# EAGLE design programmer (EAGLE 6.2)
An AVR in-system programmer.
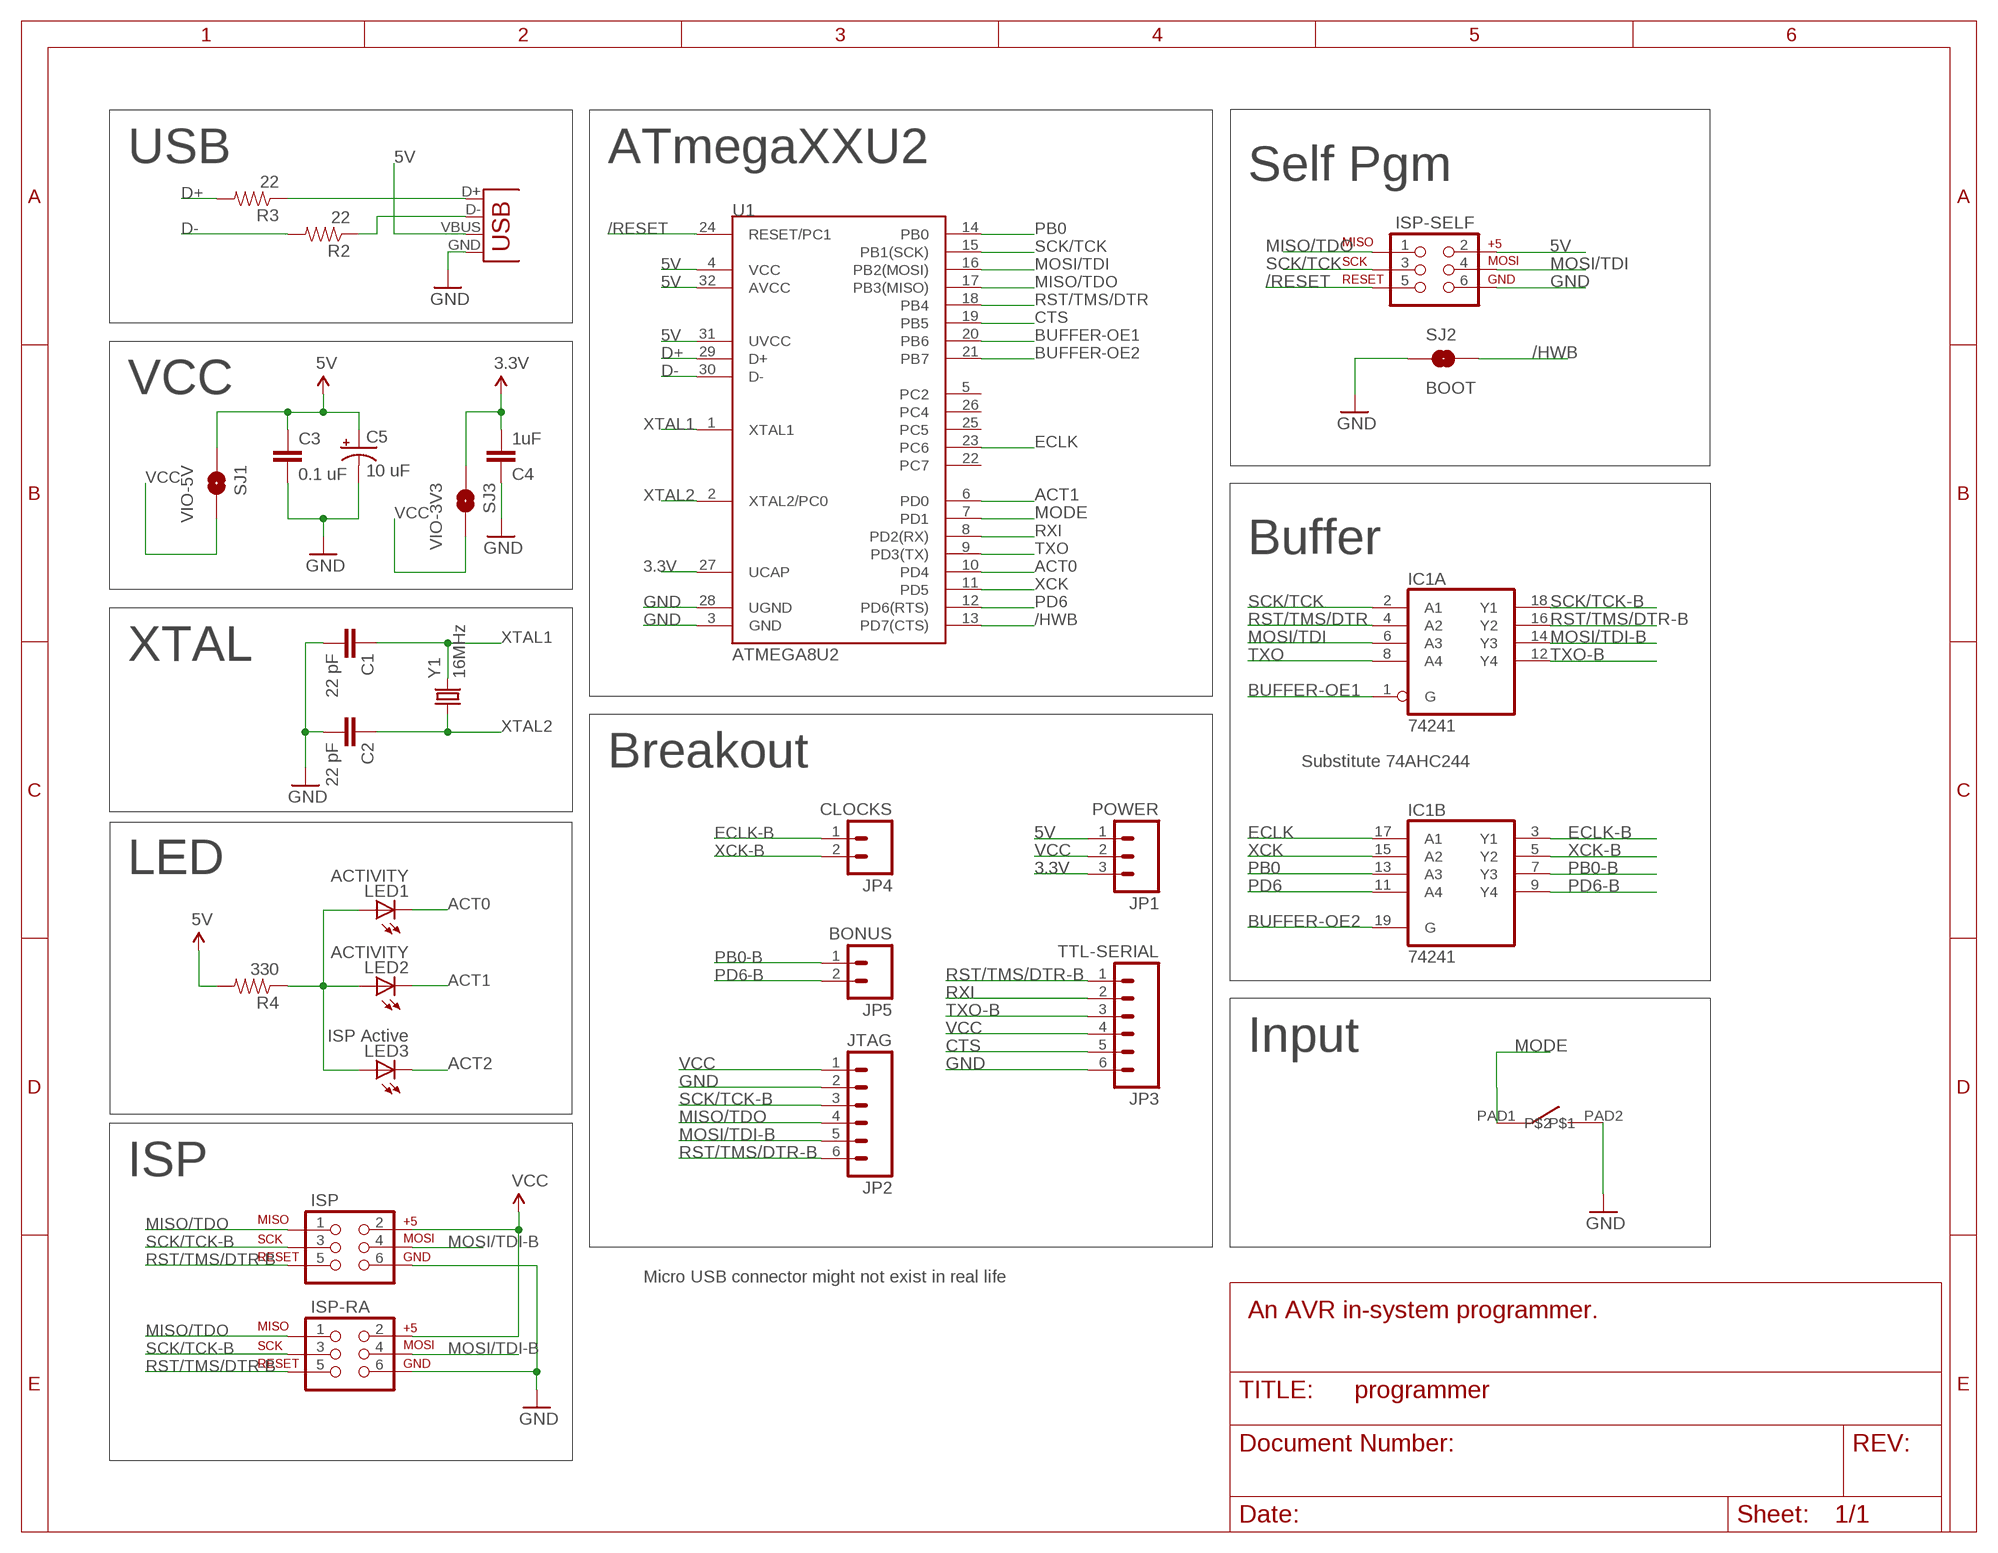
[diagram p0: schematic, sheet 1]

## Parts
C1  22 pF  SPARKFUN_CAP0805  [SPARKFUN_0805]
C2  22 pF  SPARKFUN_CAP0805  [SPARKFUN_0805]
C3  0.1 uF  SPARKFUN_CAP0805  [SPARKFUN_0805]
C4  1uF  SPARKFUN_CAP0805  [SPARKFUN_0805]
C5  10 uF  SPARKFUN_CAP_POL1206  [SPARKFUN_EIA3216]
IC1  74241  [TSSOP20]
ISP  SPARKFUN_AVR_SPI_PRG_62X3_LOCK  [SPARKFUN_2X3_LOCK]
ISP-RA  SPARKFUN_AVR_SPI_PRG_62X3_LOCK  [SPARKFUN_2X3_LOCK]
ISP-SELF  SPARKFUN_AVR_SPI_PRG_62X3_LOCK  [SPARKFUN_2X3_LOCK]
JP1  POWER  SPARKFUN_M03LOCK  [SPARKFUN_1X03_LOCK]
JP2  JTAG  SPARKFUN_M06LOCK  [SPARKFUN_1X06_LOCK]
JP3  TTL-SERIAL  SPARKFUN_M06LOCK  [SPARKFUN_1X06_LOCK]
JP4  CLOCKS  M02LOCK  [1X02_LOCK]
JP5  BONUS  M02LOCK  [1X02_LOCK]
LED1  ACTIVITY  SPARKFUN_LED  [CHIP-LED0805]
LED2  ACTIVITY  SPARKFUN_LED  [CHIP-LED0805]
LED3  ISP Active  SPARKFUN_LED  [CHIP-LED0805]
R2  22  SPARKFUN_RESISTOR0805-RES  [SPARKFUN_0805]
R3  22  SPARKFUN_RESISTOR0805-RES  [SPARKFUN_0805]
R4  330  SPARKFUN_RESISTOR0805-RES  [SPARKFUN_0805]
SJ1  VIO-5V  SPARKFUN_SOLDERJUMPERNC  [SPARKFUN_SJ_2S]
SJ2  BOOT  SPARKFUN_SOLDERJUMPERNO  [SPARKFUN_SJ_2S-NO]
SJ3  VIO-3V3  SPARKFUN_SOLDERJUMPERNC  [SPARKFUN_SJ_2S]
SW1  BUTTON_TD-85XU  [BUTTON_TD-85XU]
U1  ATMEGA8U2  SPARKFUN_ATMEGA8U2AU  [SPARKFUN_TQFP32-08]
X1  FCI_8193_MICRO_USB  [FCI_MICRO_USB_8193]
Y1  16MHz  SPARKFUN_CRYSTAL5X3  [SPARKFUN_CRYSTAL-SMD-5X3]

## Nets
3.3V: C4.2 JP1.3 SJ3.1 U1.27(UCAP)
5V [pwr/gnd]: C3.1 C5.A(+) ISP-SELF.2 JP1.1 R4.2 SJ1.1 U1.4(VCC) U1.31(UVCC) U1.32(AVCC) X1.VBUS
/HWB: SJ2.2 U1.13(PD7(CTS))
/RESET: ISP-SELF.5 U1.24(RESET/PC1)
ACT0: LED1.C U1.10(PD4)
ACT1: LED2.C U1.6(PD0)
ACT2: LED3.C
BUFFER-OE1: IC1.1(A:G) U1.20(PB6)
BUFFER-OE2: IC1.19(B:G) U1.21(PB7)
CTS: JP3.5 U1.19(PB5)
D+: R3.2 U1.29(D+)
D+RAW: R3.1 X1.D+
D-: R2.2 U1.30(D-)
D-RAW: R2.1 X1.D-
ECLK: IC1.17(B:A1) U1.23(PC6)
ECLK-B: IC1.3(B:Y1) JP4.1
GND [pwr/gnd]: C1.2 C2.2 C3.2 C4.1 C5.C(-) ISP-RA.6 ISP-SELF.6 ISP.6 JP2.2 JP3.6 SJ2.1 SW1.PAD2 U1.3(GND) U1.28(UGND) X1.GND
MISO/TDO: ISP-RA.1 ISP-SELF.1 ISP.1 JP2.4 U1.17(PB3(MISO))
MODE: SW1.PAD1 U1.7(PD1)
MOSI/TDI: IC1.6(A:A3) ISP-SELF.4 U1.16(PB2(MOSI))
MOSI/TDI-B: IC1.14(A:Y3) ISP-RA.4 ISP.4 JP2.5
PB0: IC1.13(B:A3) U1.14(PB0)
PB0-B [pwr/gnd]: IC1.7(B:Y3) JP5.1
PD6: IC1.11(B:A4) U1.12(PD6(RTS))
PD6-B [pwr/gnd]: IC1.9(B:Y4) JP5.2
RST/TMS/DTR: IC1.4(A:A2) U1.18(PB4)
RST/TMS/DTR-B: IC1.16(A:Y2) ISP-RA.5 ISP.5 JP2.6 JP3.1
RXI: JP3.2 U1.8(PD2(RX))
SCK/TCK: IC1.2(A:A1) ISP-SELF.3 U1.15(PB1(SCK))
SCK/TCK-B: IC1.18(A:Y1) ISP-RA.3 ISP.3 JP2.3
TXO: IC1.8(A:A4) U1.9(PD3(TX))
TXO-B: IC1.12(A:Y4) JP3.3
VCC [pwr/gnd]: ISP-RA.2 ISP.2 JP1.2 JP2.1 JP3.4 SJ1.2 SJ3.2
VCC-LED: LED1.A LED2.A R4.1
VCC-LED1: LED3.A
XCK: IC1.15(B:A2) U1.11(PD5)
XCK-B: IC1.5(B:Y2) JP4.2
XTAL1: C1.1 U1.1(XTAL1) Y1.3
XTAL2: C2.1 U1.2(XTAL2/PC0) Y1.1
Unconnected: U1.5(PC2) U1.22(PC7) U1.25(PC5) U1.26(PC4)

## Notes on the sheet
- USB | ATmegaXXU2
- Self Pgm
- VCC
- Buffer
- XTAL
- Breakout | Substitute 74AHC244
- LED
- Input
- ISP
- Micro USB connector might not exist in real life
- An AVR in-system programmer.

## Power pins joined to a net without a drawn wire
GND: IC1.10(P:GND)
VCC: IC1.20(P:VCC)

## Library data of the parts
C1-C4 = programmer:SPARKFUN_CAP: Capacitor Standard 0603 ceramic capacitor, and 0.1" leaded capacitor.
C5 = programmer:SPARKFUN_CAP_POL: Capacitor Polarized These are standard SMD and PTH capacitors. Normally 10uF, 47uF, and 100uF in electrolytic and tantalum varieties. Always verify the external diameter of the through hole cap, it varies with capacity, voltage, and manufacturer. The EIA devices should be standard.
IC1 = programmer:74*241: Octal BUFFER and LINE DRIVER, 3-state
ISP ISP-RA ISP-SELF = programmer:SPARKFUN_AVR_SPI_PRG_6: AVR ISP 6 Pin This is the reduced ISP connector for AVR programming. Common on Arduino. This footprint will take up less PCB space and can be used with a 10-pin to 6-pin adapter such as SKU: BOB-08508
JP1 = programmer:SPARKFUN_M03: Header 3 Standard 3-pin 0.1" header. Use with straight break away headers (SKU : PRT-00116), right angle break away headers (PRT-00553), swiss pins (PRT-00743), machine pins (PRT-00117), and female headers (PRT-00115). Molex polarized connector foot print use with SKU : PRT-08232 with associated crimp pins and housings.
JP2 JP3 = programmer:SPARKFUN_M06
JP4 JP5 = programmer:M02: Header 2 Standard 2-pin 0.1" header. Use with straight break away headers (SKU : PRT-00116), right angle break away headers (PRT-00553), swiss pins (PRT-00743), machine pins (PRT-00117), and female headers (PRT-00115). Molex polarized connector foot print use with SKU : PRT-08233 with associated crimp pins and housings.
LED1-LED3 = programmer:SPARKFUN_LED: LEDs Standard schematic elements and footprints for 5mm, 3mm, 1206, and 0603 sized LEDs. 5mm - Spark Fun Electronics SKU : COM-00529 (and others)
R2-R4 = programmer:SPARKFUN_RESISTOR: Resistor Basic schematic elements and footprints for 0603, 1206, and PTH resistors.
SJ1-SJ3 = programmer:SPARKFUN_SOLDERJUMPER: Solder Jumper Standard SMD solder jumper. Used to automate production. Two varients : Normally Open and Normally Closed are the same, but have different paste layers. NC will have a large amount of paste and should jumper during reflow.
SW1 = programmer:BUTTON_TD-85XU
U1 = programmer:SPARKFUN_ATMEGA8U2: Atmel 8-bit Microcontroller with 8/16/32K Bystes of ISP Flash and USB Controller. ATmega8U2, ATmega16U2, and ATmega32U2
X1 = programmer:FCI_8193_MICRO_USB
Y1 = programmer:SPARKFUN_CRYSTAL: Crystals Various standard crystals. Proven footprints. Spark Fun Electronics SKU : COM-00534

## Net classes
0 default: width 0.203 mm, clearance 0.203 mm
1 pwr/gnd: width 0.305 mm

## Board
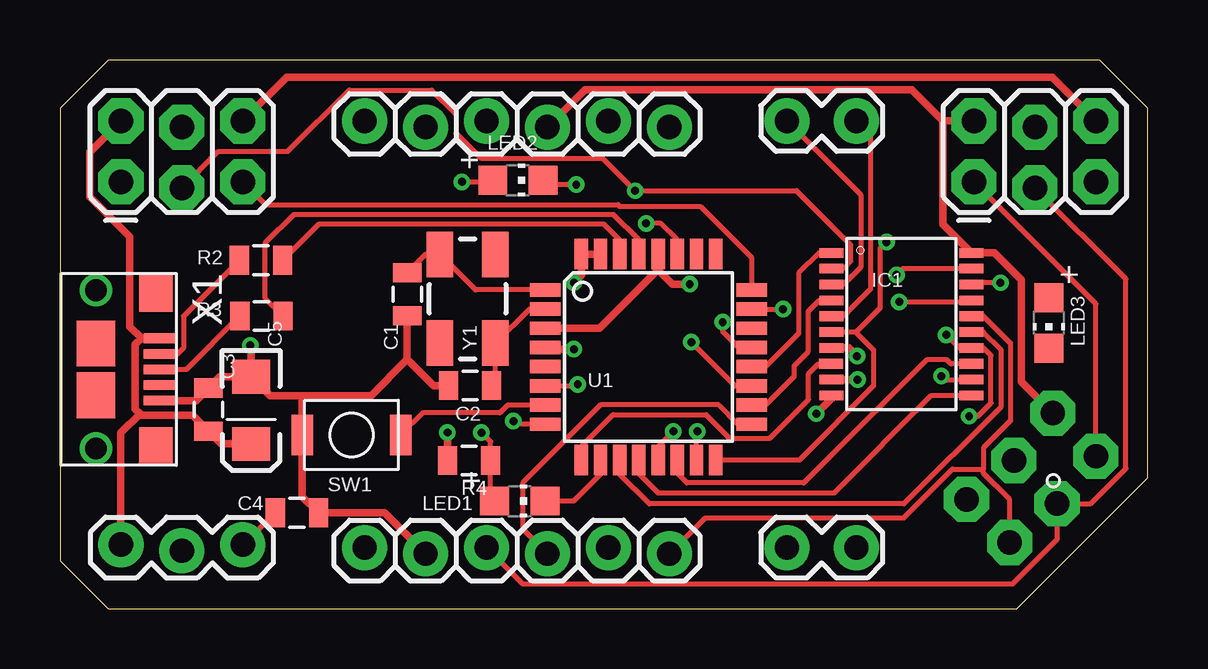
[diagram p1: board, top side]
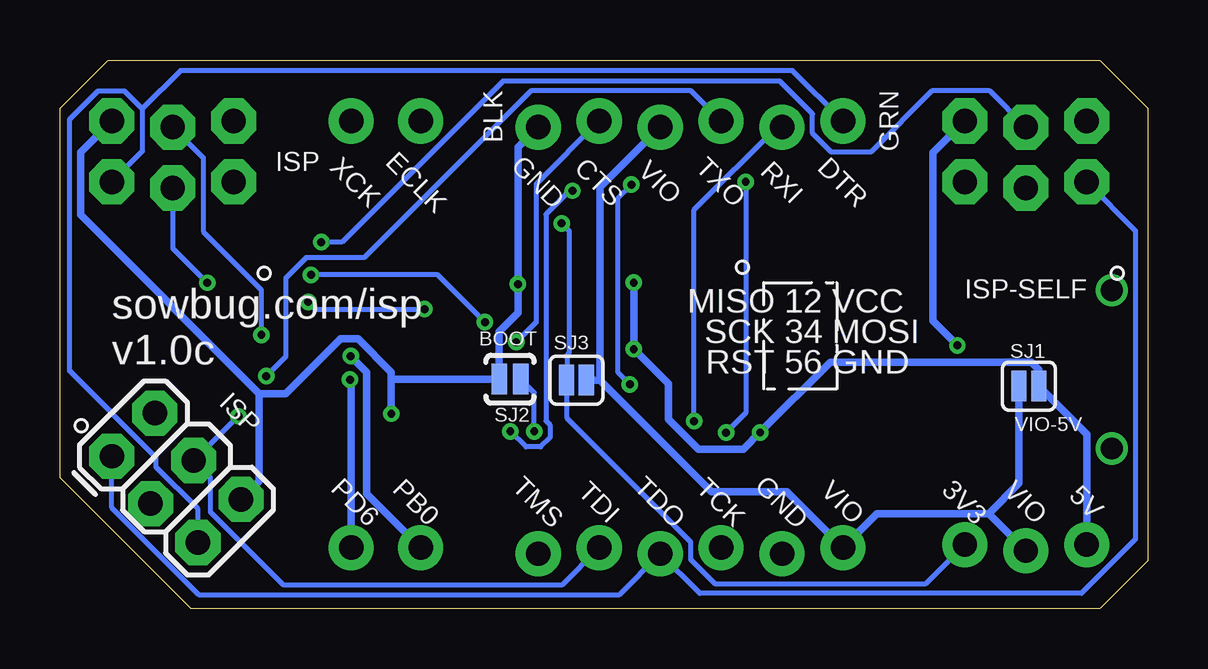
[diagram p2: board, bottom side, seen from below]

Size 45.34 x 22.86 mm. Coordinates in mm from the lower left corner, seen from the top.
Outline: 45.34,5.46 45.34,20.86 43.34,22.86 2,22.86 0,20.86 0,2 2,0 39.88,0 45.34,5.46
Copper layers (1*16): Top 0.0356mm / dielectric 1.5011mm / Bottom 0.0356mm
Design rules: minimum track width 6mil, minimum drill 13mil, track to track 6mil, track to pad 6mil, pad to pad 6mil, via to via 6mil, smd to smd 6mil, copper to edge 15mil, drill to drill 6mil, minimum pad ring 7mil, minimum via ring 7mil, stop-mask expansion 4mil, vias tented up to drill 0mil, thermal gap 10mil

### Footprints (pad centres in the part's own frame; a part is rotated, then mirrored left to right if it is on the bottom)
SPARKFUN_0805 = smd 0.8 x 1.2: 1 -0.9,0; 2 0.9,0
SPARKFUN_EIA3216 = smd 1.4 x 1.6: A 1.4,0; C -1.4,0
TSSOP20 = smd 1 x 0.4: 1 -2.937,2.693; 2 -2.937,2.032; 3 -2.937,1.372; 4 -2.937,0.712; 5 -2.937,0.051; 6 -2.937,-0.609; 7 -2.937,-1.27; 8 -2.943,-1.93; 9 -2.937,-2.59; 10 -2.937,-3.251; 11 2.905,-3.251; 12 2.905,-2.59; 13 2.911,-1.93; 14 2.905,-1.27; 15 2.905,-0.609; 16 2.905,0.051; 17 2.905,0.712; 18 2.905,1.372; 19 2.905,2.032; 20 2.905,2.693
SPARKFUN_2X3_LOCK = drill 1.016 pad 1.88 octagon: 1 0,0; 2 0,2.54; 3 2.54,-0.254; 4 2.54,2.286; 5 5.08,0; 6 5.08,2.54
SPARKFUN_1X03_LOCK = drill 1.016 pad 1.88: 1 0,0.127; 2 2.54,-0.127; 3 5.08,0.127
SPARKFUN_1X06_LOCK = drill 1.016 pad 1.88: 1 0,0; 2 2.54,-0.254; 3 5.08,0; 4 7.62,-0.254; 5 10.16,0; 6 12.7,-0.254
1X02_LOCK = drill 1.016 pad 1.88: 1 -0.178,0; 2 2.718,0
CHIP-LED0805 = smd 1.2 x 1.2: A 0,-1.05; C 0,1.05
SPARKFUN_SJ_2S = smd 0.635 x 1.27: 1 -0.412,0; 2 0.412,0
SPARKFUN_SJ_2S-NO = smd 0.635 x 1.27: 1 -0.45,0; 2 0.45,0
BUTTON_TD-85XU = smd 0.9 x 1.7: PAD1 -2.05,0; PAD2 2.05,0
SPARKFUN_TQFP32-08 = smd 1.27 x 0.559: 1 -4.293,2.8; 2 -4.293,2; 3 -4.293,1.2; 4 -4.293,0.4; 5 -4.293,-0.4; 6 -4.293,-1.2; 7 -4.293,-2; 8 -4.293,-2.8; 17 4.293,-2.8; 18 4.293,-2; 19 4.293,-1.2; 20 4.293,-0.4; 21 4.293,0.4; 22 4.293,1.2; 23 4.293,2; 24 4.293,2.8 | smd 0.559 x 1.27: 9 -2.8,-4.293; 10 -2,-4.293; 11 -1.2,-4.293; 12 -0.4,-4.293; 13 0.4,-4.293; 14 1.2,-4.293; 15 2,-4.293; 16 2.8,-4.293; 25 2.8,4.293; 26 2,4.293; 27 1.2,4.293; 28 0.4,4.293; 29 -0.4,4.293; 30 -1.2,4.293; 31 -2,4.293; 32 -2.8,4.293
FCI_MICRO_USB_8193 = smd 0.4 x 1.35: D+ 0,2.675; D- -0.65,2.675; GND 1.3,2.675; ID 0.65,2.675; VBUS -1.3,2.675 | smd 1.6 x 1.4: MNT1 -3.2,2.5; MNT2 3.2,2.5 | smd 1.9 x 1.6: MNT3 -1.075,0; MNT4 1.075,0 | drill 0.9: P$1 -3.3,0; P$2 3.3,0
SPARKFUN_CRYSTAL-SMD-5X3 = smd 1.9 x 1.1: 1 -1.85,-1.15; 2 1.85,-1.15; 3 1.85,1.15; 4 -1.85,1.15

### Placement (x,y rotation side)
C1  14.48,13.1 270 top
C2  17.1,9.3 180 top
C3  6.19,8.29 90 top
C4  9.88,3.99 180 top
C5  7.97,8.26 270 top
IC1  35.09,12.13 0 top
ISP  38.1,17.78 0 top
ISP-RA  43.18,6.35 315 bottom
ISP-SELF  2.54,17.78 0 top
JP1  2.54,2.54 0 top
JP2  12.7,2.54 0 top
JP3  12.7,20.32 0 top
JP4  30.48,20.32 0 top
JP5  30.48,2.54 0 top
LED1  19.17,4.48 270 top
LED2  19.09,17.85 270 top
LED3  41.22,11.9 180 top
R2  8.38,14.52 0 top
R3  8.4,12.2 0 top
R4  17.05,6.17 180 top
SJ1  4.95,9.27 180 bottom
SJ2  26.58,9.56 0 bottom
SJ3  23.81,9.52 0 bottom
SW1  12.15,7.24 180 top
U1  24.53,10.48 0 top
X1  1.5,9.97 270 top
Y1  16.99,12.91 90 top

### Tracks (layer width: path | path; a pad name or v marks a point on that pad's centre or on a via)
3.3V  (via drill 0.33 pad 0.69)
  Top 0.203: JP1.3 7.66,2.67 C4.2 | U1.27 25.73,15.36 25.04,16.05 v24.43,16.05
  Bottom 0.203: v24.43,16.05 24.11,15.74 | 24.11,15.74 | 24.11,15.74 24.11,13.62 24.11,11.26 | 24.11,11.26 | 24.11,11.26 24.11,10.68 24.2,10.59 SJ3.1 24.22,7.96 19.05,2.79 19.05,2.05 18.04,1.04 9.25,1.04 JP1.3
5V  (via drill 0.33 pad 0.69)
  Top 0.305: C5.A 6.72,6.86 C3.1 5.53,8.05 3.4,8.05 3.34,8.12 | v21.42,13.58 21.73,13.89 U1.32 U1.31 | v21.42,10.81 20.31,10.81 U1.4 | R4.2 v16.15,7.34 | 3.34,8.12 2.54,7.32 JP1.1 | 3.4,11.27 2.91,11.75 2.91,15.49 1.24,17.17 1.24,19.02 ISP-SELF.2 | X1.VBUS 3.4,11.27 | 3.4,11.27 3.14,11.01 3.14,8.32 3.34,8.12
  Bottom 0.305: JP1.1 2.54,7.27 SJ1.1 4.54,9.95 4.85,10.26 13.23,10.26 v16.15,7.34 16.86,6.63 18.72,6.63 19.97,7.88 19.97,9.36 v21.42,10.81 v21.42,13.58
/HWB  (via drill 0.33 pad 0.69)
  Top 0.203: U1.13 24.93,6.75 v25.57,7.39
  Bottom 0.203: v25.57,7.39 25.57,9 SJ2.2
/RESET
  Top 0.203: ISP-SELF.5 8.57,16.83 23.27,16.83 23.33,16.77 26.69,16.77 28.82,14.63 U1.24
ACT0
  Top 0.203: U1.10 22.53,5.61 21.41,4.48 LED1.C
ACT1  (via drill 0.33 pad 0.69)
  Top 0.203: v21.52,17.67 20.32,17.67 LED2.C | U1.6 21.52,9.28 v21.58,9.34
  Bottom 0.203: v21.58,9.34 22.07,9.84 22.07,17.11 v21.52,17.67
BUFFER-OE1
  Top 0.203: IC1.1 31.65,14.82 30.79,13.97 30.79,11.46 29.41,10.08 U1.20
BUFFER-OE2  (via drill 0.33 pad 0.69)
  Top 0.203: IC1.19 35.13,14.16 v34.87,13.91 | U1.21 28.28,10.88 27.62,11.54 v27.62,11.94
  Bottom 0.203: v27.62,11.94 29.59,13.91 v34.87,13.91
CTS  (via drill 0.33 pad 0.69)
  Top 0.203: U1.19 28.14,9.28 v26.32,11.1
  Bottom 0.203: JP3.5 25.5,17.68 25.5,11.93 v26.32,11.1
D+
  Top 0.203: U1.29 24.13,15.37 23.08,16.42 9.74,16.42 8.54,15.22 8.54,12.96 R3.2
D+RAW
  Top 0.203: X1.D+ 5.27,9.97 R3.1
D-
  Top 0.203: U1.30 23.33,15.36 22.68,16.02 10.78,16.02 R2.2
D-RAW
  Top 0.203: R2.1 5.15,12.19 5.15,10.86 4.91,10.62 X1.D-
ECLK  (via drill 0.33 pad 0.69)
  Top 0.203: U1.23 v30.14,12.48 | v34.99,12.79 37.93,12.79 IC1.17
  Bottom 0.203: v34.99,12.79 34.69,12.48 v30.14,12.48
ECLK-B
  Top 0.203: JP4.1 33.38,17.24 33.38,14.23 32.65,13.51 IC1.3
GND  (via drill 0.33 pad 0.69)
  Top 0.305: 10.1,8.87 SW1.PAD2 10.1,4.66 C4.1 13.54,3.99 JP2.2 | 10.1,8.87 12.96,8.87 14.48,10.38 | C5.C 8.76,8.87 10.1,8.87 | 14.48,10.38 C1.2 | C2.2 15.57,9.3 14.48,10.38 | C5.C 6.66,9.66 C3.2 5.67,8.67 X1.GND | 24.93,14.12 25.54,13.52 v26.25,13.52 | IC1.10 32.15,8.74 v31.53,8.12 | ISP-SELF.6 9.44,22.14 41.36,22.14 ISP.6 | 24.93,14.12 U1.28 | 24.93,14.12 22.49,11.68 U1.3 | v7.93,10.97 7.97,10.93 C5.C
  Bottom 0.305: 37.03,8.96 35.92,8.96 33.65,11.24 32.92,11.24 31.53,9.85 31.53,9.56 | ISP.6 44.48,19.02 44.48,16.42 37.03,8.96 | 37.03,8.96 37.03,5.32 ISP-RA.6 | 31.53,9.56 v31.53,8.12 | 31.53,9.56 SJ2.1 27.03,11.54 26.25,12.32 v26.25,13.52 26.25,19.22 JP3.6 | ISP-SELF.6 8.95,18.99 8.95,11.99 v7.93,10.97 | ISP-RA.6 37.85,4.57 ISP-RA.6
MISO/TDO
  Top 0.203: U1.17 28.27,7.68 27.46,8.49 22.54,8.49 19.29,5.24 19.29,3.32 JP2.4 | ISP-RA.1 43.18,12.7 ISP.1
  Bottom 0.203: ISP-SELF.1 0.51,15.75 0.51,2.88 2.76,0.63 18.67,0.63 JP2.4 22.04,0.57 39.53,0.57 43.18,4.21 ISP-RA.1
MODE
  Top 0.203: U1.7 18.66,8.48 18.34,8.16 15.13,8.16 SW1.PAD1
MOSI/TDI  (via drill 0.33 pad 0.69)
  Top 0.203: 33.18,11.52 33.91,10.79 33.91,9.28 30.83,6.19 U1.16 | 33.18,11.52 IC1.6 | 33.18,11.52 34.19,12.53 34.19,15.02 v34.45,15.27
  Bottom 0.203: ISP-SELF.4 6.59,21.57 8.99,21.57 11.54,19.02 13.18,19.02 13.97,19.81 13.97,20.61 15.34,21.98 26.88,21.98 33.59,15.27 v34.45,15.27
MOSI/TDI-B  (via drill 0.33 pad 0.69)
  Top 0.203: v36.95,11.41 37.49,10.86 IC1.14 38.49,10.86 38.8,10.55 38.8,8.56 38.26,8.02 v37.9,8.02
  Bottom 0.203: ISP.4 39.37,18.8 39.37,15.71 36.95,13.29 v36.95,11.41 | 39.61,6.33 ISP-RA.4 39.07,5.47 39.07,4.04 36.04,1 24.4,1 JP2.5 | 39.61,6.33 37.92,8.02 v37.9,8.02 | ISP-RA.4 39.62,6.35 39.61,6.33
PB0
  Top 0.203: IC1.13 37.14,10.2 36.98,10.37 36.13,10.37 31,5.24 26.13,5.24 25.73,5.64 U1.14
PB0-B  (via drill 0.33 pad 0.69)
  Top 0.305: IC1.7 32.88,10.86 v33.22,10.52
  Bottom 0.305: JP5.1 32.55,4.79 32.55,9.85 v33.22,10.52
PD6
  Top 0.203: U1.12 24.13,5.62 24.92,4.83 32.27,4.83 36.33,8.88 IC1.11
PD6-B  (via drill 0.33 pad 0.69)
  Top 0.305: v33.25,9.54 IC1.9
  Bottom 0.305: JP5.2 33.2,9.49 v33.25,9.54
RST/TMS/DTR
  Top 0.203: U1.18 29.41,8.48 30.61,9.68 30.61,10.12 31.2,10.71 31.2,12.39 31.65,12.84 IC1.4
RST/TMS/DTR-B
  Top 0.203: IC1.16 38.49,12.18 39.62,11.06 39.62,7.82 38.49,6.7 38.49,5.81 | ISP-RA.5 | ISP-RA.5 39.59,2.79 | 39.59,2.79 39.59,4.55 38.49,5.65 38.49,5.81 | JP2.6 26.9,3.79 35.18,3.79 37.21,5.81 38.49,5.81 | ISP-RA.5 39.62,2.79 39.59,2.79
  Bottom 0.203: ISP-RA.5 | ISP-RA.5 39.59,2.79 | 39.59,2.79 39.59,4.16 41.33,5.9 41.33,6.3 44.94,9.91 44.94,20.38 43.75,21.58 42.66,21.58 41.91,20.83 | 41.91,20.83 41.91,19.05 ISP.5 | JP3.1 14.8,22.42 40.31,22.42 41.91,20.83 | ISP-RA.5 39.62,2.79 39.59,2.79
RXI  (via drill 0.33 pad 0.69)
  Top 0.203: U1.8 19.03,7.68 v18.91,7.81
  Bottom 0.203: v18.91,7.81 18.91,16.62 15.46,20.07 JP3.2
SCK/TCK  (via drill 0.33 pad 0.69)
  Top 0.203: U1.15 26.53,7.35 v26.57,7.39 | IC1.2 32.65,14.16 32.95,14.47 32.95,15.16 30.71,17.41 v23.97,17.41 22.61,18.77 17.54,18.77 16.51,19.8 16.51,20.59 15.5,21.6 12.05,21.6 9.5,19.05 6.6,19.05 ISP-SELF.3
  Bottom 0.203: v23.97,17.41 24.11,17.41 25.09,16.43 25.09,7.82 24.92,7.66 24.92,7.12 25.3,6.74 25.92,6.74 v26.57,7.39
SCK/TCK-B  (via drill 0.33 pad 0.69)
  Top 0.203: ISP-RA.3 42.97,4.37 44.43,5.83 44.43,13.74 ISP.3 | JP2.3 19.29,1.03 39.71,1.03 41.56,2.89 41.56,4.32 | 41.56,4.32 ISP-RA.3 | v39.2,13.58 38.06,13.58 IC1.18 | ISP-RA.3 41.66,4.32 41.56,4.32
  Bottom 0.203: ISP.3 40.64,15.02 v39.2,13.58
TXO
  Top 0.203: U1.9 21.73,6.76 23.05,8.08 26.93,8.08 27.92,7.1 29.59,7.1 31.2,8.71 31.2,9.79 31.61,10.2 IC1.8
TXO-B  (via drill 0.33 pad 0.69)
  Top 0.203: v36.74,9.69 36.89,9.54 IC1.12
  Bottom 0.203: JP3.3 19.04,21.57 25.71,21.57 32.66,14.63 35.08,14.63 35.93,13.78 35.93,10.5 v36.74,9.69
VCC
  Top 0.305: ISP-RA.2 40.07,9.46 40.07,13.7 38.94,14.82 IC1.20 36.8,16.01 36.8,20.32 | ISP.2 36.8,20.32 | JP3.4 21.88,21.62 35.5,21.62 36.8,20.32 | ISP-RA.2 41.4,8.13 ISP-RA.2
  Bottom 0.305: 22.84,9.52 22.84,17.55 JP3.4 | 22.84,9.52 18.19,4.88 15.04,4.88 JP2.1 11.28,3.96 6.63,3.96 | SJ3.2 22.84,9.52 | 6.63,3.96 JP1.2 | SJ1.2 5.37,5.23 6.63,3.96
VCC-LED  (via drill 0.33 pad 0.69)
  Top 0.203: v17.57,7.34 17.95,6.96 R4.1 17.95,4.65 LED1.A | v16.75,17.78 17.97,17.78 LED2.A
  Bottom 0.203: v16.75,17.78 16.75,8.15 v17.57,7.34
XCK
  Top 0.203: IC1.15 38.49,11.52 39.21,10.81 39.21,8.39 35.19,4.37 24.57,4.37 23.33,5.6 U1.11
XCK-B
  Top 0.203: JP4.2 33.78,19.73 33.78,13.32 32.65,12.18 IC1.5
XTAL1
  Top 0.203: U1.1 17.32,13.28 Y1.3 15.24,14.76 C1.1
XTAL2
  Top 0.203: U1.2 19.56,12.48 Y1.1 18.14,10.43 18.14,9.81 18,9.66 C2.1

### Text on the board
bPlace: DTR | RXI | TXO | VIO | CTS | GND | ECLK | XCK | 2 VCC | MISO 1 | sowbug.com/isp | 4 MOSI | SCK 3 | 6 GND | RST 5 | v1.0c | 5V | VIO | 3V3 | VIO | GND | TCK | TDO | TDI | TMS | PB0 | PD6
bNames: GRN | BLK | ISP | ISP-SELF | ISP